# Altium schematic sheet 通用工装板01.SchDoc: MCU
size A3; Date: 20190212; CompanyName: 瑞臻信息（深圳）有限公司; DrawnBy: bob.xu; Address1: 深圳市南山区深南路万利达大厦2201室; Address2: 昆山市花桥镇花桥国际商务城绿地大道231弄9号楼杰座大厦2111室; Address3: 成都市高新区天府二街138号蜀都中心3号楼3110室; Address4: 浙江省宁波市余姚市冶山路475号1401室; Revision: v1.00; SheetOf: 1/3; ProductTitle: 通用测试工装; ModuleTitle: MCU; : CheckedBy
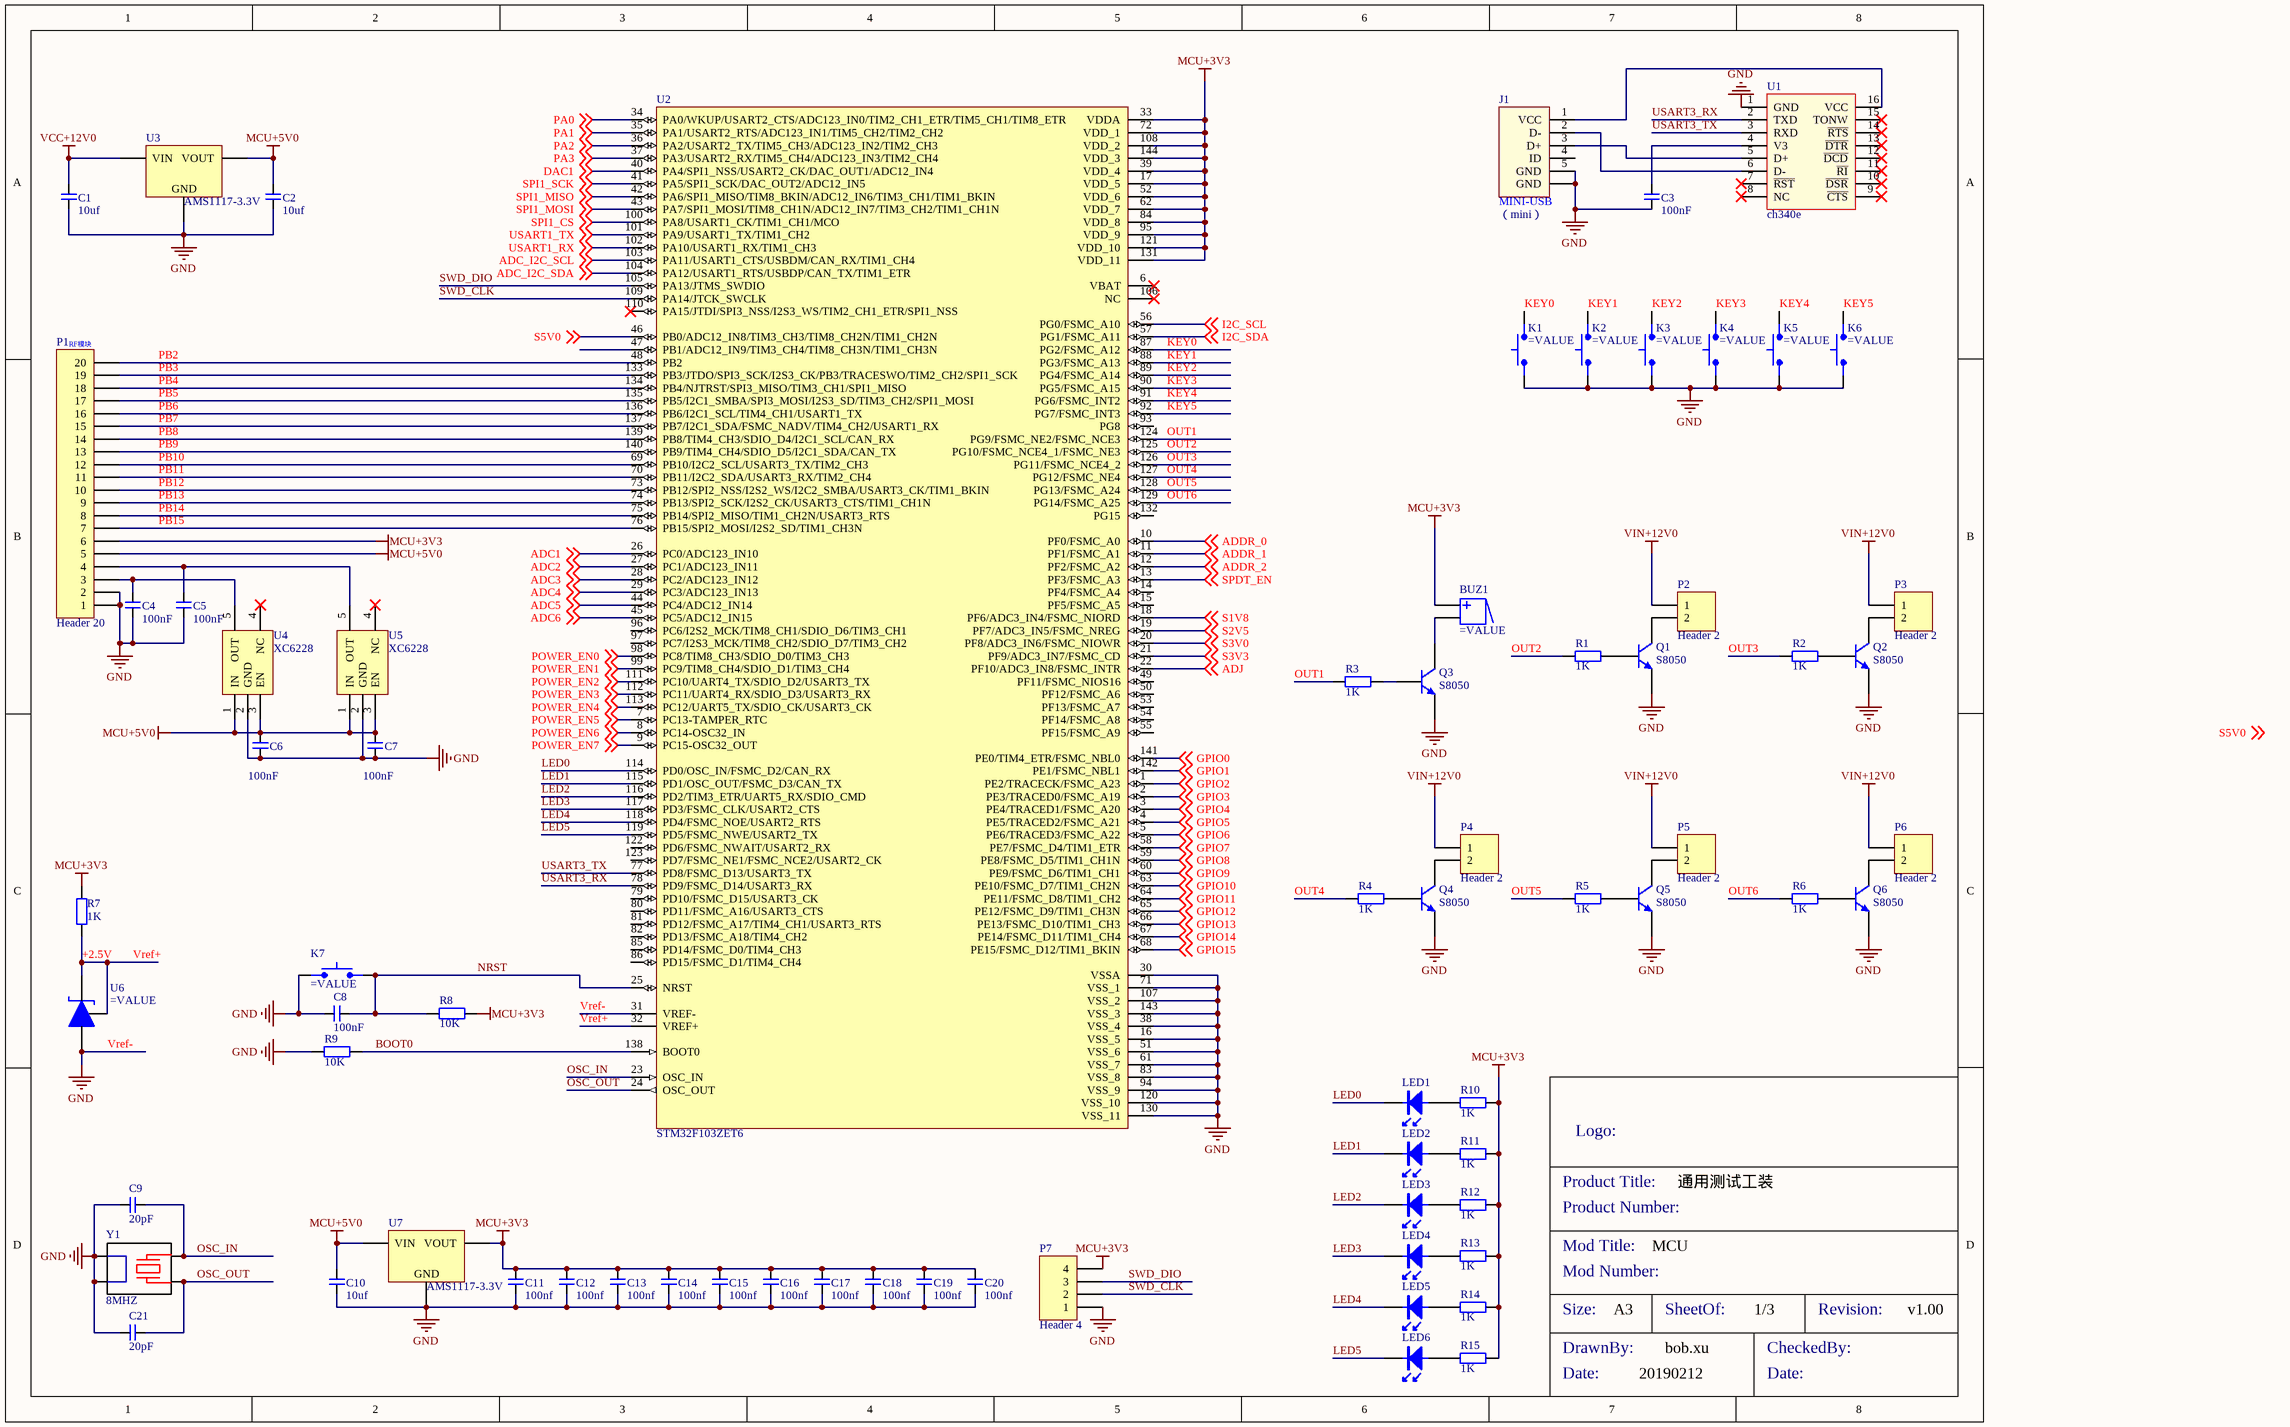
[diagram p0: 通用工装板01.SchDoc]

## Parts
BUZ1  (no value)  [DIP_BUZZER_2P_6R5_D12H9]
C1  10uf  [C1206]
C2  10uf  [C1206]
C3  100nF  [c0402]
C4  100nF  [c0402]
C5  100nF  [c0402]
C6  100nF  [c0402]
C7  100nF  [c0402]
C8  100nF  [c0402]
C9  20pF  [c0402]
C10  10uf  [C1206]
C11  100nf  [c0402]
C12  100nf  [c0402]
C13  100nf  [c0402]
C14  100nf  [c0402]
C15  100nf  [c0402]
C16  100nf  [c0402]
C17  100nf  [c0402]
C18  100nf  [c0402]
C19  100nf  [c0402]
C20  100nf  [c0402]
C21  20pF  [c0402]
J1  （mini）  [DIP_MINI_USB_1]
K1  (no value)  [SMD_SWITCH_2P_3R5X6R0]
K2  (no value)  [SMD_SWITCH_2P_3R5X6R0]
K3  (no value)  [SMD_SWITCH_2P_3R5X6R0]
K4  (no value)  [SMD_SWITCH_2P_3R5X6R0]
K5  (no value)  [SMD_SWITCH_2P_3R5X6R0]
K6  (no value)  [SMD_SWITCH_2P_3R5X6R0]
K7  (no value)  [SMD_SWITCH_2P_3R5X6R0]
LED1  (no value)  [led0603+]
LED2  (no value)  [led0603+]
LED3  (no value)  [led0603+]
LED4  (no value)  [led0603+]
LED5  (no value)  [led0603+]
LED6  (no value)  [led0603+]
P1  Header 20  [HDR1X20]
P2  Header 2  [HDR1X2]
P3  Header 2  [HDR1X2]
P4  Header 2  [HDR1X2]
P5  Header 2  [HDR1X2]
P6  Header 2  [HDR1X2]
P7  Header 4  [HDR1X4]
Q1  S8050  [SOT23_3P_0R95_1R6X2R9]
Q2  S8050  [SOT23_3P_0R95_1R6X2R9]
Q3  S8050  [SOT23_3P_0R95_1R6X2R9]
Q4  S8050  [SOT23_3P_0R95_1R6X2R9]
Q5  S8050  [SOT23_3P_0R95_1R6X2R9]
Q6  S8050  [SOT23_3P_0R95_1R6X2R9]
R1  1K  [r0402]
R2  1K  [r0402]
R3  1K  [r0402]
R4  1K  [r0402]
R5  1K  [r0402]
R6  1K  [r0402]
R7  1K  [R0402]
R8  10K  [R0402]
R9  10K  [R0402]
R10  1K  [r0402]
R11  1K  [r0402]
R12  1K  [r0402]
R13  1K  [r0402]
R14  1K  [r0402]
R15  1K  [r0402]
U1  ch340e  [SOP_16P_1R27_4R0X10R0]
U2  STM32F103ZET6  [LQFP_144P_0R5_20R0X20R0]
U3  AMS1117-3.3V  [SOT223_4P_2R3_3R7X6R7]
U4  XC6228  [SOT23_5P_0R95_1R6X2R9]
U5  XC6228  [SOT23_5P_0R95_1R6X2R9]
U6  (no value)  [SOT23_3P_0R95_1R3X2R9]
U7  AMS1117-3.3V  [SOT223_4P_2R3_3R7X6R7]
Y1  8MHZ  [SMD_Crystal_4P_2R5X3R2]

## Nets
MCU+3V3: BUZ1.1 C11.2 C12.2 C13.2 C14.2 C15.2 C16.2 C17.2 C18.2 C19.2 C20.2 P1.6 P7.4 R7.2 R8.2 R10.2 R11.2 R12.2 R13.2 R14.2 R15.2 U2.17(VDD_5) U2.33(VDDA) U2.39(VDD_4) U2.52(VDD_6) U2.62(VDD_7) U2.72(VDD_1) U2.84(VDD_8) U2.95(VDD_9) U2.108(VDD_2) U2.121(VDD_10) U2.131(VDD_11) U2.144(VDD_3) U7.2(VOUT)
MCU+5V0: C2.2 C6.2 C7.2 C10.2 P1.5 U3.2(VOUT) U4.1(IN) U4.3(EN) U5.1(IN) U5.3(EN) U7.3(VIN)
VCC+12V0: C1.2 U3.3(VIN)
VIN+12V0: P2.1 P3.1 P4.1 P5.1 P6.1
Vref-: C1.1 C2.1 C3.1 C4.2 C5.2 C6.1 C7.1 C8.1 C9.1 C10.1 C11.1 C12.1 C13.1 C14.1 C15.1 C16.1 C17.1 C18.1 C19.1 C20.1 C21.1 J1.5(GND) J1.A(GND) K1.1 K2.1 K3.1 K4.1 K5.1 K6.1 K7.1 P1.1 P1.2 P7.1 Q1.2(E) Q2.2(E) Q3.2(E) Q4.2(E) Q5.2(E) Q6.2(E) R9.1 U1.1(GND) U2.16(VSS_5) U2.30(VSSA) U2.31(VREF-) U2.38(VSS_4) U2.51(VSS_6) U2.61(VSS_7) U2.71(VSS_1) U2.83(VSS_8) U2.94(VSS_9) U2.107(VSS_2) U2.120(VSS_10) U2.130(VSS_11) U2.143(VSS_3) U3.1(GND) U4.2(GND) U5.2(GND) U6.3(A) U7.1(GND) Y1.2 Y1.4  [also labelled GND]
+2.5V: R7.1 U2.32(VREF+) U6.1(K) U6.2(REF)  [also labelled Vref+]
ADC1: U2.26(PC0/ADC123_IN10) ; off-sheet ADC1
ADC2: U2.27(PC1/ADC123_IN11) ; off-sheet ADC2
ADC3: U2.28(PC2/ADC123_IN12) ; off-sheet ADC3
ADC4: U2.29(PC3/ADC123_IN13) ; off-sheet ADC4
ADC5: U2.44(PC4/ADC12_IN14) ; off-sheet ADC5
ADC6: U2.45(PC5/ADC12_IN15) ; off-sheet ADC6
ADC_I2C_SCL: U2.103(PA11/USART1_CTS/USBDM/CAN_RX/TIM1_CH4) ; off-sheet ADC_I2C_SCL
ADC_I2C_SDA: U2.104(PA12/USART1_RTS/USBDP/CAN_TX/TIM1_ETR) ; off-sheet ADC_I2C_SDA
ADDR_0: U2.10(PF0/FSMC_A0) ; off-sheet ADDR_0
ADDR_1: U2.11(PF1/FSMC_A1) ; off-sheet ADDR_1
ADDR_2: U2.12(PF2/FSMC_A2) ; off-sheet ADDR_2
ADJ: U2.22(PF10/ADC3_IN8/FSMC_INTR) ; off-sheet ADJ
BOOT0: R9.2 U2.138(BOOT0)
DAC1: U2.40(PA4/SPI1_NSS/USART2_CK/DAC_OUT1/ADC12_IN4) ; off-sheet DAC1
GPIO0: U2.141(PE0/TIM4_ETR/FSMC_NBL0) ; off-sheet GPIO0
GPIO1: U2.142(PE1/FSMC_NBL1) ; off-sheet GPIO1
GPIO2: U2.1(PE2/TRACECK/FSMC_A23) ; off-sheet GPIO2
GPIO3: U2.2(PE3/TRACED0/FSMC_A19) ; off-sheet GPIO3
GPIO4: U2.3(PE4/TRACED1/FSMC_A20) ; off-sheet GPIO4
GPIO5: U2.4(PE5/TRACED2/FSMC_A21) ; off-sheet GPIO5
GPIO6: U2.5(PE6/TRACED3/FSMC_A22) ; off-sheet GPIO6
GPIO7: U2.58(PE7/FSMC_D4/TIM1_ETR) ; off-sheet GPIO7
GPIO8: U2.59(PE8/FSMC_D5/TIM1_CH1N) ; off-sheet GPIO8
GPIO9: U2.60(PE9/FSMC_D6/TIM1_CH1) ; off-sheet GPIO9
GPIO10: U2.63(PE10/FSMC_D7/TIM1_CH2N) ; off-sheet GPIO10
GPIO11: U2.64(PE11/FSMC_D8/TIM1_CH2) ; off-sheet GPIO11
GPIO12: U2.65(PE12/FSMC_D9/TIM1_CH3N) ; off-sheet GPIO12
GPIO13: U2.66(PE13/FSMC_D10/TIM1_CH3) ; off-sheet GPIO13
GPIO14: U2.67(PE14/FSMC_D11/TIM1_CH4) ; off-sheet GPIO14
GPIO15: U2.68(PE15/FSMC_D12/TIM1_BKIN) ; off-sheet GPIO15
I2C_SCL: U2.56(PG0/FSMC_A10) ; off-sheet I2C_SCL
I2C_SDA: U2.57(PG1/FSMC_A11) ; off-sheet I2C_SDA
KEY0: K1.2 U2.87(PG2/FSMC_A12)
KEY1: K2.2 U2.88(PG3/FSMC_A13)
KEY2: K3.2 U2.89(PG4/FSMC_A14)
KEY3: K4.2 U2.90(PG5/FSMC_A15)
KEY4: K5.2 U2.91(PG6/FSMC_INT2)
KEY5: K6.2 U2.92(PG7/FSMC_INT3)
LED0: LED1.2(K) U2.114(PD0/OSC_IN/FSMC_D2/CAN_RX)
LED1: LED2.2(K) U2.115(PD1/OSC_OUT/FSMC_D3/CAN_TX)
LED2: LED3.2(K) U2.116(PD2/TIM3_ETR/UART5_RX/SDIO_CMD)
LED3: LED4.2(K) U2.117(PD3/FSMC_CLK/USART2_CTS)
LED4: LED5.2(K) U2.118(PD4/FSMC_NOE/USART2_RTS)
LED5: LED6.2(K) U2.119(PD5/FSMC_NWE/USART2_TX)
NRST: C8.2 K7.2 R8.1 U2.25(NRST)
OSC_IN: C9.2 U2.23(OSC_IN) Y1.1
OSC_OUT: C21.2 U2.24(OSC_OUT) Y1.3
OUT1: R3.1 U2.124(PG9/FSMC_NE2/FSMC_NCE3)
OUT2: R1.1 U2.125(PG10/FSMC_NCE4_1/FSMC_NE3)
OUT3: R2.1 U2.126(PG11/FSMC_NCE4_2)
OUT4: R4.1 U2.127(PG12/FSMC_NE4)
OUT5: R5.1 U2.128(PG13/FSMC_A24)
OUT6: R6.1 U2.129(PG14/FSMC_A25)
PA0: U2.34(PA0/WKUP/USART2_CTS/ADC123_IN0/TIM2_CH1_ETR/TIM5_CH1/TIM8_ETR) ; off-sheet PA0
PA1: U2.35(PA1/USART2_RTS/ADC123_IN1/TIM5_CH2/TIM2_CH2) ; off-sheet PA1
PA2: U2.36(PA2/USART2_TX/TIM5_CH3/ADC123_IN2/TIM2_CH3) ; off-sheet PA2
PA3: U2.37(PA3/USART2_RX/TIM5_CH4/ADC123_IN3/TIM2_CH4) ; off-sheet PA3
PB2: P1.20 U2.48(PB2)
PB3: P1.19 U2.133(PB3/JTDO/SPI3_SCK/I2S3_CK/PB3/TRACESWO/TIM2_CH2/SPI1_SCK)
PB4: P1.18 U2.134(PB4/NJTRST/SPI3_MISO/TIM3_CH1/SPI1_MISO)
PB5: P1.17 U2.135(PB5/I2C1_SMBA/SPI3_MOSI/I2S3_SD/TIM3_CH2/SPI1_MOSI)
PB6: P1.16 U2.136(PB6/I2C1_SCL/TIM4_CH1/USART1_TX)
PB7: P1.15 U2.137(PB7/I2C1_SDA/FSMC_NADV/TIM4_CH2/USART1_RX)
PB8: P1.14 U2.139(PB8/TIM4_CH3/SDIO_D4/I2C1_SCL/CAN_RX)
PB9: P1.13 U2.140(PB9/TIM4_CH4/SDIO_D5/I2C1_SDA/CAN_TX)
PB10: P1.12 U2.69(PB10/I2C2_SCL/USART3_TX/TIM2_CH3)
PB11: P1.11 U2.70(PB11/I2C2_SDA/USART3_RX/TIM2_CH4)
PB12: P1.10 U2.73(PB12/SPI2_NSS/I2S2_WS/I2C2_SMBA/USART3_CK/TIM1_BKIN)
PB13: P1.9 U2.74(PB13/SPI2_SCK/I2S2_CK/USART3_CTS/TIM1_CH1N)
PB14: P1.8 U2.75(PB14/SPI2_MISO/TIM1_CH2N/USART3_RTS)
PB15: P1.7 U2.76(PB15/SPI2_MOSI/I2S2_SD/TIM1_CH3N)
POWER_EN0: U2.98(PC8/TIM8_CH3/SDIO_D0/TIM3_CH3) ; off-sheet POWER_EN0
POWER_EN1: U2.99(PC9/TIM8_CH4/SDIO_D1/TIM3_CH4) ; off-sheet POWER_EN1
POWER_EN2: U2.111(PC10/UART4_TX/SDIO_D2/USART3_TX) ; off-sheet POWER_EN2
POWER_EN3: U2.112(PC11/UART4_RX/SDIO_D3/USART3_RX) ; off-sheet POWER_EN3
POWER_EN4: U2.113(PC12/UART5_TX/SDIO_CK/USART3_CK) ; off-sheet POWER_EN4
POWER_EN5: U2.7(PC13-TAMPER_RTC) ; off-sheet POWER_EN5
POWER_EN6: U2.8(PC14-OSC32_IN) ; off-sheet POWER_EN6
POWER_EN7: U2.9(PC15-OSC32_OUT) ; off-sheet POWER_EN7
S1V8: U2.18(PF6/ADC3_IN4/FSMC_NIORD) ; off-sheet S1V8
S2V5: U2.19(PF7/ADC3_IN5/FSMC_NREG) ; off-sheet S2V5
S3V0: U2.20(PF8/ADC3_IN6/FSMC_NIOWR) ; off-sheet S3V0
S3V3: U2.21(PF9/ADC3_IN7/FSMC_CD) ; off-sheet S3V3
S5V0: U2.46(PB0/ADC12_IN8/TIM3_CH3/TIM8_CH2N/TIM1_CH2N) ; off-sheet S5V0
SPDT_EN: U2.13(PF3/FSMC_A3) ; off-sheet SPDT_EN
SPI1_CS: U2.100(PA8/USART1_CK/TIM1_CH1/MCO) ; off-sheet SPI1_CS
SPI1_MISO: U2.42(PA6/SPI1_MISO/TIM8_BKIN/ADC12_IN6/TIM3_CH1/TIM1_BKIN) ; off-sheet SPI1_MISO
SPI1_MOSI: U2.43(PA7/SPI1_MOSI/TIM8_CH1N/ADC12_IN7/TIM3_CH2/TIM1_CH1N) ; off-sheet SPI1_MOSI
SPI1_SCK: U2.41(PA5/SPI1_SCK/DAC_OUT2/ADC12_IN5) ; off-sheet SPI1_SCK
SWD_CLK: P7.2 U2.109(PA14/JTCK_SWCLK)
SWD_DIO: P7.3 U2.105(PA13/JTMS_SWDIO)
USART1_RX: U2.102(PA10/USART1_RX/TIM1_CH3) ; off-sheet USART1_RX
USART1_TX: U2.101(PA9/USART1_TX/TIM1_CH2) ; off-sheet USART1_TX
USART3_RX: U1.2(TXD) U2.78(PD9/FSMC_D14/USART3_RX)
USART3_TX: U1.3(RXD) U2.77(PD8/FSMC_D13/USART3_TX)
NetBUZ1_2: BUZ1.2 Q3.3(C)
NetC3_2: C3.2 U1.4(V3)
NetC4_1: C4.1 P1.3 U4.5(OUT)
NetC5_1: C5.1 P1.4 U5.5(OUT)
NetJ1_1: J1.1(VCC) U1.16(VCC)
NetJ1_2: J1.2(D-) U1.6(D-)
NetJ1_3: J1.3(D+) U1.5(D+)
NetLED1_1: LED1.1(A) R10.1
NetLED2_1: LED2.1(A) R11.1
NetLED3_1: LED3.1(A) R12.1
NetLED4_1: LED4.1(A) R13.1
NetLED5_1: LED5.1(A) R14.1
NetLED6_1: LED6.1(A) R15.1
NetP2_2: P2.2 Q1.3(C)
NetP3_2: P3.2 Q2.3(C)
NetP4_2: P4.2 Q4.3(C)
NetP5_2: P5.2 Q5.3(C)
NetP6_2: P6.2 Q6.3(C)
NetQ1_1: Q1.1(B) R1.2
NetQ2_1: Q2.1(B) R2.2
NetQ3_1: Q3.1(B) R3.2
NetQ4_1: Q4.1(B) R4.2
NetQ5_1: Q5.1(B) R5.2
NetQ6_1: Q6.1(B) R6.2

Not connected (* = marked no-connect by the designer): J1 4(ID); U1 7(~{RST})* 8(NC)* 9(~{CTS})* 10(~{DSR})* 11(~{RI})* 12(~{DCD})* 13(~{DTR})* 14(~{RTS})* 15(TONW)*; U2 6(VBAT)* 14(PF4/FSMC_A4) 15(PF5/FSMC_A5) 47(PB1/ADC12_IN9/TIM3_CH4/TIM8_CH3N/TIM1_CH3N) 49(PF11/FSMC_NIOS16) 50(PF12/FSMC_A6) 53(PF13/FSMC_A7) 54(PF14/FSMC_A8) 55(PF15/FSMC_A9) 79(PD10/FSMC_D15/USART3_CK) 80(PD11/FSMC_A16/USART3_CTS) 81(PD12/FSMC_A17/TIM4_CH1/USART3_RTS) 82(PD13/FSMC_A18/TIM4_CH2) 85(PD14/FSMC_D0/TIM4_CH3) 86(PD15/FSMC_D1/TIM4_CH4) 93(PG8) 96(PC6/I2S2_MCK/TIM8_CH1/SDIO_D6/TIM3_CH1) 97(PC7/I2S3_MCK/TIM8_CH2/SDIO_D7/TIM3_CH2) 106(NC)* 110(PA15/JTDI/SPI3_NSS/I2S3_WS/TIM2_CH1_ETR/SPI1_NSS)* 122(PD6/FSMC_NWAIT/USART2_RX) 123(PD7/FSMC_NE1/FSMC_NCE2/USART2_CK) 132(PG15); U4 4(NC)*; U5 4(NC)*

## Notes on the sheet
- (near P1) RF模块
- Labels drawn without touching a wire or pin: S5V0
- Product Title:
- Logo:
- Product Number:
- Mod Title:
- Size:
- Mod Number:
- A3
- SheetOf:
- Revision:
- DrawnBy:
- Date:
- CheckedBy:
- (in symbol USB座子-2（mini）) MINI-USB

## Library data of the parts
BUZ1 = 有源蜂鸣器
C1-C8 C10-C20 = 1.2.04.05.0001: MLCC_47uF±20%_6.3V_X5R_H1.6mm_1206; Value: 20pF; 厂家: 三星; 器件高度: 1.6mm; 厂家型号: CL31A476MQHNNNE; D/S: S; Edit Note: V1.0-创建-20180711-徐永伟; 器件状态: 试产; Part Number: 1.2.04.05.0001; Part Type: MLCC; ComponentLink1URL: z:\规格书\02原材料\04电容\05瓷片电容\SAMS-S-A0000377162-1.pdf; Unit Price: ￥0.001; Footprint: 1206; ComponentLink1Description: 规格书; Component Type: standy; Pin Count: 2; Published: V1.0; Publisher: 徐永伟
C9 C21 = 1.2.04.05.0001: MLCC_47uF±20%_6.3V_X5R_H1.6mm_1206; 厂家: 三星; 器件高度: 1.6mm; 厂家型号: CL31A476MQHNNNE; D/S: S; Edit Note: V1.0-创建-20180711-徐永伟; 器件状态: 试产; Part Number: 1.2.04.05.0001; Part Type: MLCC; Value: 20pF; ComponentLink1URL: z:\规格书\02原材料\04电容\05瓷片电容\SAMS-S-A0000377162-1.pdf; Unit Price: ￥0.001; Footprint: 1206; ComponentLink1Description: 规格书; Component Type: standy; Pin Count: 2; Published: V1.0; Publisher: 徐永伟
J1 = USB座子-2（mini）
K1-K7 = 2脚按键-1
LED1-LED6 = 单LED
P1 = Header 20: Header, 20-Pin; LatestRevisionDate: 17-Jul-2002; LatestRevisionNote: Re-released for DXP Platform.; Publisher: Altium Limited
P2-P6 = Header 2: Header, 2-Pin; LatestRevisionDate: 17-Jul-2002; LatestRevisionNote: Re-released for DXP Platform.; Publisher: Altium Limited
P7 = Header 4: Header, 4-Pin; LatestRevisionDate: 17-Jul-2002; LatestRevisionNote: Re-released for DXP Platform.; Publisher: Altium Limited
Q1-Q6 = NPN三极管
R1-R6 R10-R15 = 普通电阻
R7-R9 = 1.2.03.01.0006: 电阻-100R±5%-1/16W-0402; Value: 100R±5%; 单价: ￥0.001; 封装: 0402; D/S: S; 焊点: 2; 版本: V1.0; 创建者: 徐永伟; 编辑记录: V1.0-创建-20161225-徐永伟; 物料等级: 在库; Part Number: 1.2.03.01.0006; Part Type: 贴片电阻; 供应商: 供应商; 厂家: 厂家; ComponentLink1Description: 规格书; ComponentLink2Description: ROHS报告; ComponentLink5Description: 代理资质; ComponentLink3Description: 可靠性测试报告; ComponentLink4Description: 性能检测报告
U1 = CH340B
U3 U7 = 1.2.18.07.0001: AMS1117_LDO稳压_800mA/3.3V_60dB_SOT223-3; 厂家: AMS; 器件高度: 1.8mm; 单价: ￥0.001; D/S: S; Edit Note: V1.0-创建-20180709-徐永伟; 物料状态: 研发; Part Number: 1.2.18.07.0001; Part Type: LDO; Value: AMS1117-3.3; ComponentLink1URL: Z:\规格书\02原材料\18集成电路\07DCDC转换器\1.2.18.07.0324\规格书.pdf; 厂家型号: AMS1117-3.3; Footprint: SOT223; ComponentLink1Description: 规格书; Component Type: standy; ComponentLink2Description: ROHS报告; Pin Count: 4; Published: V1.0; Publisher: 徐永伟
U6 = TL431A
Y1 = 四脚晶体谐振器